# Altium schematic sheet CATS-FAT-Overview.SchDoc: CATS Pro
size A4; Author: Luca Jost; Revision: 1.0; SheetNumber: 1; SheetTotal: 13; Subtitle: Overview
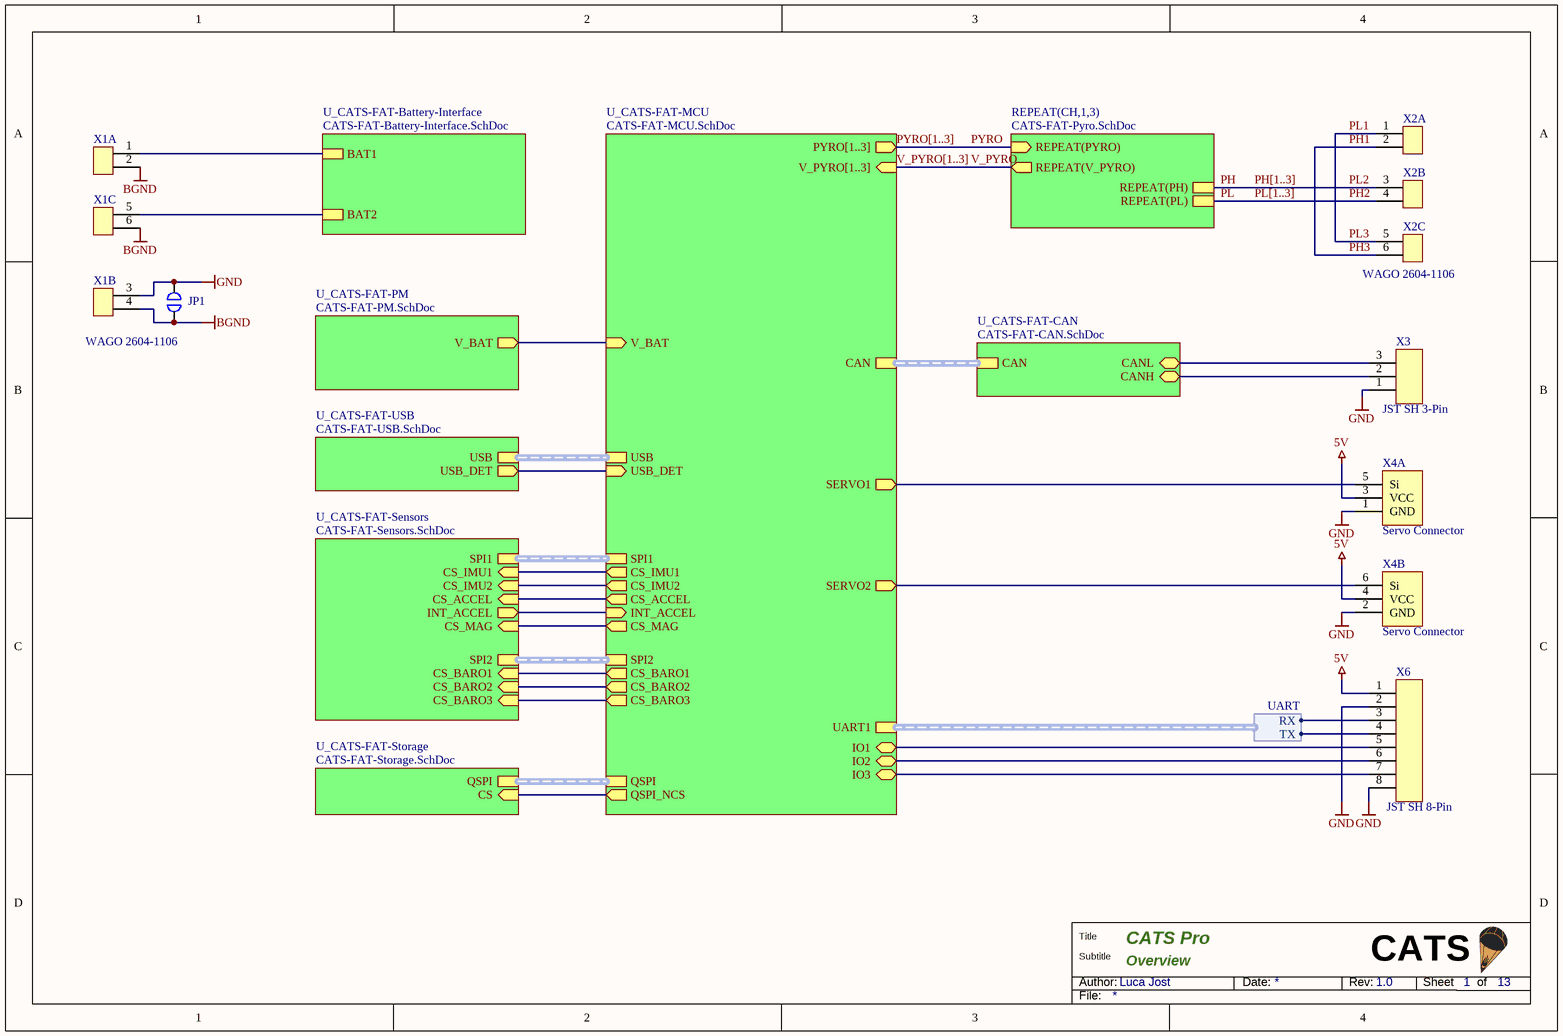
[diagram p0: CATS-FAT-Overview.SchDoc]

## Parts
JP1  Jumper  [SMD Solder Jumper 1x2mm]  (value not drawn)  (no BOM)
X1  WAGO 2604-1106  [THT PCB Terminal Wago 2604-1106]  (value not drawn)  (parts A,B,C of 3)
X2  WAGO 2604-1106  [THT PCB Terminal Wago 2604-1106]  (value not drawn)  (parts A,B,C of 3)
X3  JST SH 3-Pin  [SMD CONNECTOR JST-SR 3 PIN]
X4  Servo Connector  [THT Stiftleiste 6-Pol (2x3) 90°]  (parts A,B of 2)
X6  JST SH 8-Pin  [SMD CONNECTOR JST-SR 8 PIN]

## Sub-sheets
REPEAT(CH,1,3) = CATS-FAT-Pyro.SchDoc: REPEAT(PYRO) (in), REPEAT(V_PYRO) (out), REPEAT(PH), REPEAT(PL)
U_CATS-FAT-Battery-Interface = CATS-FAT-Battery-Interface.SchDoc: BAT1, BAT2
U_CATS-FAT-CAN = CATS-FAT-CAN.SchDoc: CAN (harness CAN), CANH (bidir), CANL (bidir)
U_CATS-FAT-MCU = CATS-FAT-MCU.SchDoc: SPI1 (harness SPI), SPI2 (harness SPI), CS_IMU1 (out), CS_IMU2 (out), CS_ACCEL (out), INT_ACCEL (in), CS_MAG (out), CS_BARO1 (out), CS_BARO2 (out), CS_BARO3 (out), V_PYRO[1..3] (in), PYRO[1..3] (out), USB_DET (in), QSPI (harness QSPI), QSPI_NCS (out), CAN (harness CAN), V_BAT (in), IO1 (bidir), IO2 (bidir), IO3 (bidir), UART1 (harness UART), SERVO1 (out), SERVO2 (out), USB (harness USB)
U_CATS-FAT-PM = CATS-FAT-PM.SchDoc: V_BAT (out)
U_CATS-FAT-Sensors = CATS-FAT-Sensors.SchDoc: CS_IMU1 (in), CS_IMU2 (in), CS_ACCEL (in), INT_ACCEL (out), CS_BARO1 (in), CS_BARO2 (in), CS_BARO3 (in), SPI1, SPI2, CS_MAG (in)
U_CATS-FAT-Storage = CATS-FAT-Storage.SchDoc: QSPI (harness QSPI), CS (in)
U_CATS-FAT-USB = CATS-FAT-USB.SchDoc: USB (harness USB), USB_DET (out)

## Harnesses
UART: TX, RX

## Nets
5V: X4.3(VCC) X4.4(VCC) X6.1
BGND: JP1.2 X1.2 X1.4 X1.6
GND: JP1.1 X1.3 X3.1 X4.1(GND) X4.2(GND) X6.2 X6.8
PH: sheet REPEAT(CH,1,3)/REPEAT(PH)
PH1: X2.2
PH2: X2.4
PH3: X2.6
PL: sheet REPEAT(CH,1,3)/REPEAT(PL)
PL1: X2.1
PL2: X2.3
PL3: X2.5
PYRO: sheet REPEAT(CH,1,3)/REPEAT(PYRO)
V_PYRO: sheet REPEAT(CH,1,3)/REPEAT(V_PYRO)
NetX1_1: X1.1 ; sheet U_CATS-FAT-Battery-Interface/BAT1
NetX1_5: X1.5 ; sheet U_CATS-FAT-Battery-Interface/BAT2
NetX3_2: X3.2 ; sheet U_CATS-FAT-CAN/CANH
NetX3_3: X3.3 ; sheet U_CATS-FAT-CAN/CANL
NetX4_5: X4.5(Si) ; sheet U_CATS-FAT-MCU/SERVO1
NetX4_6: X4.6(Si) ; sheet U_CATS-FAT-MCU/SERVO2
NetX6_3: X6.3 ; sheet U_CATS-FAT-MCU/UART1.RX
NetX6_4: X6.4 ; sheet U_CATS-FAT-MCU/UART1.TX
NetX6_5: X6.5 ; sheet U_CATS-FAT-MCU/IO1
NetX6_6: X6.6 ; sheet U_CATS-FAT-MCU/IO2
NetX6_7: X6.7 ; sheet U_CATS-FAT-MCU/IO3
(unnamed): sheet U_CATS-FAT-Sensors/CS_IMU1, sheet U_CATS-FAT-MCU/CS_IMU1
(unnamed): sheet U_CATS-FAT-Sensors/CS_IMU2, sheet U_CATS-FAT-MCU/CS_IMU2
(unnamed): sheet U_CATS-FAT-Sensors/CS_ACCEL, sheet U_CATS-FAT-MCU/CS_ACCEL
(unnamed): sheet U_CATS-FAT-Sensors/INT_ACCEL, sheet U_CATS-FAT-MCU/INT_ACCEL
(unnamed): sheet U_CATS-FAT-Sensors/CS_BARO1, sheet U_CATS-FAT-MCU/CS_BARO1
(unnamed): sheet U_CATS-FAT-Sensors/CS_BARO2, sheet U_CATS-FAT-MCU/CS_BARO2
(unnamed): sheet U_CATS-FAT-Sensors/CS_BARO3, sheet U_CATS-FAT-MCU/CS_BARO3
(unnamed): sheet U_CATS-FAT-Sensors/CS_MAG, sheet U_CATS-FAT-MCU/CS_MAG
(unnamed): sheet U_CATS-FAT-Storage/CS, sheet U_CATS-FAT-MCU/QSPI_NCS
(unnamed): sheet U_CATS-FAT-PM/V_BAT, sheet U_CATS-FAT-MCU/V_BAT
(unnamed): sheet U_CATS-FAT-USB/USB_DET, sheet U_CATS-FAT-MCU/USB_DET

## Buses and harness runs
bus PH[1..3]
bus PL[1..3]
bus PYRO[1..3] = sheet U_CATS-FAT-MCU/PYRO[1..3]
bus V_PYRO[1..3] = sheet U_CATS-FAT-MCU/V_PYRO[1..3]
harness sheet U_CATS-FAT-CAN/CAN = sheet U_CATS-FAT-MCU/CAN
harness sheet U_CATS-FAT-MCU/QSPI = sheet U_CATS-FAT-Storage/QSPI
harness sheet U_CATS-FAT-MCU/SPI1 = sheet U_CATS-FAT-Sensors/SPI1
harness sheet U_CATS-FAT-MCU/SPI2 = sheet U_CATS-FAT-Sensors/SPI2
harness sheet U_CATS-FAT-MCU/USB = sheet U_CATS-FAT-USB/USB

## Notes on the sheet
- Title
- Author:
- Subtitle
- Date:
- Rev:
- CATS
- Sheet
- of
- File:

## Library data of the parts
JP1 = Jumper-1: Single Position Jumper
X1 X2 = WAGO 2604-1106: PCB terminal blocks with levers and Push-in CAGE CLAMP® connection; ComponentLink1Description: Datasheet; ComponentLink1URL: https://www.wago.com/us/pcb-interconnect/pcb-terminal-block/p/2604-1106
X3 = JST SH 3-Pin: Crimp Style Connectors (Wire-to-Board type); Digikey: 455-1803-2-ND
X4 = Servo Connector Dual: 6 Pin header for PWM servos
X6 = JST SH 8-Pin: Crimp Style Connectors (Wire-to-Board type); Digikey: 455-1808-1-ND